# EAGLE schematic PRECISION_CLOCK V0.3 (EAGLE 9.6.2)
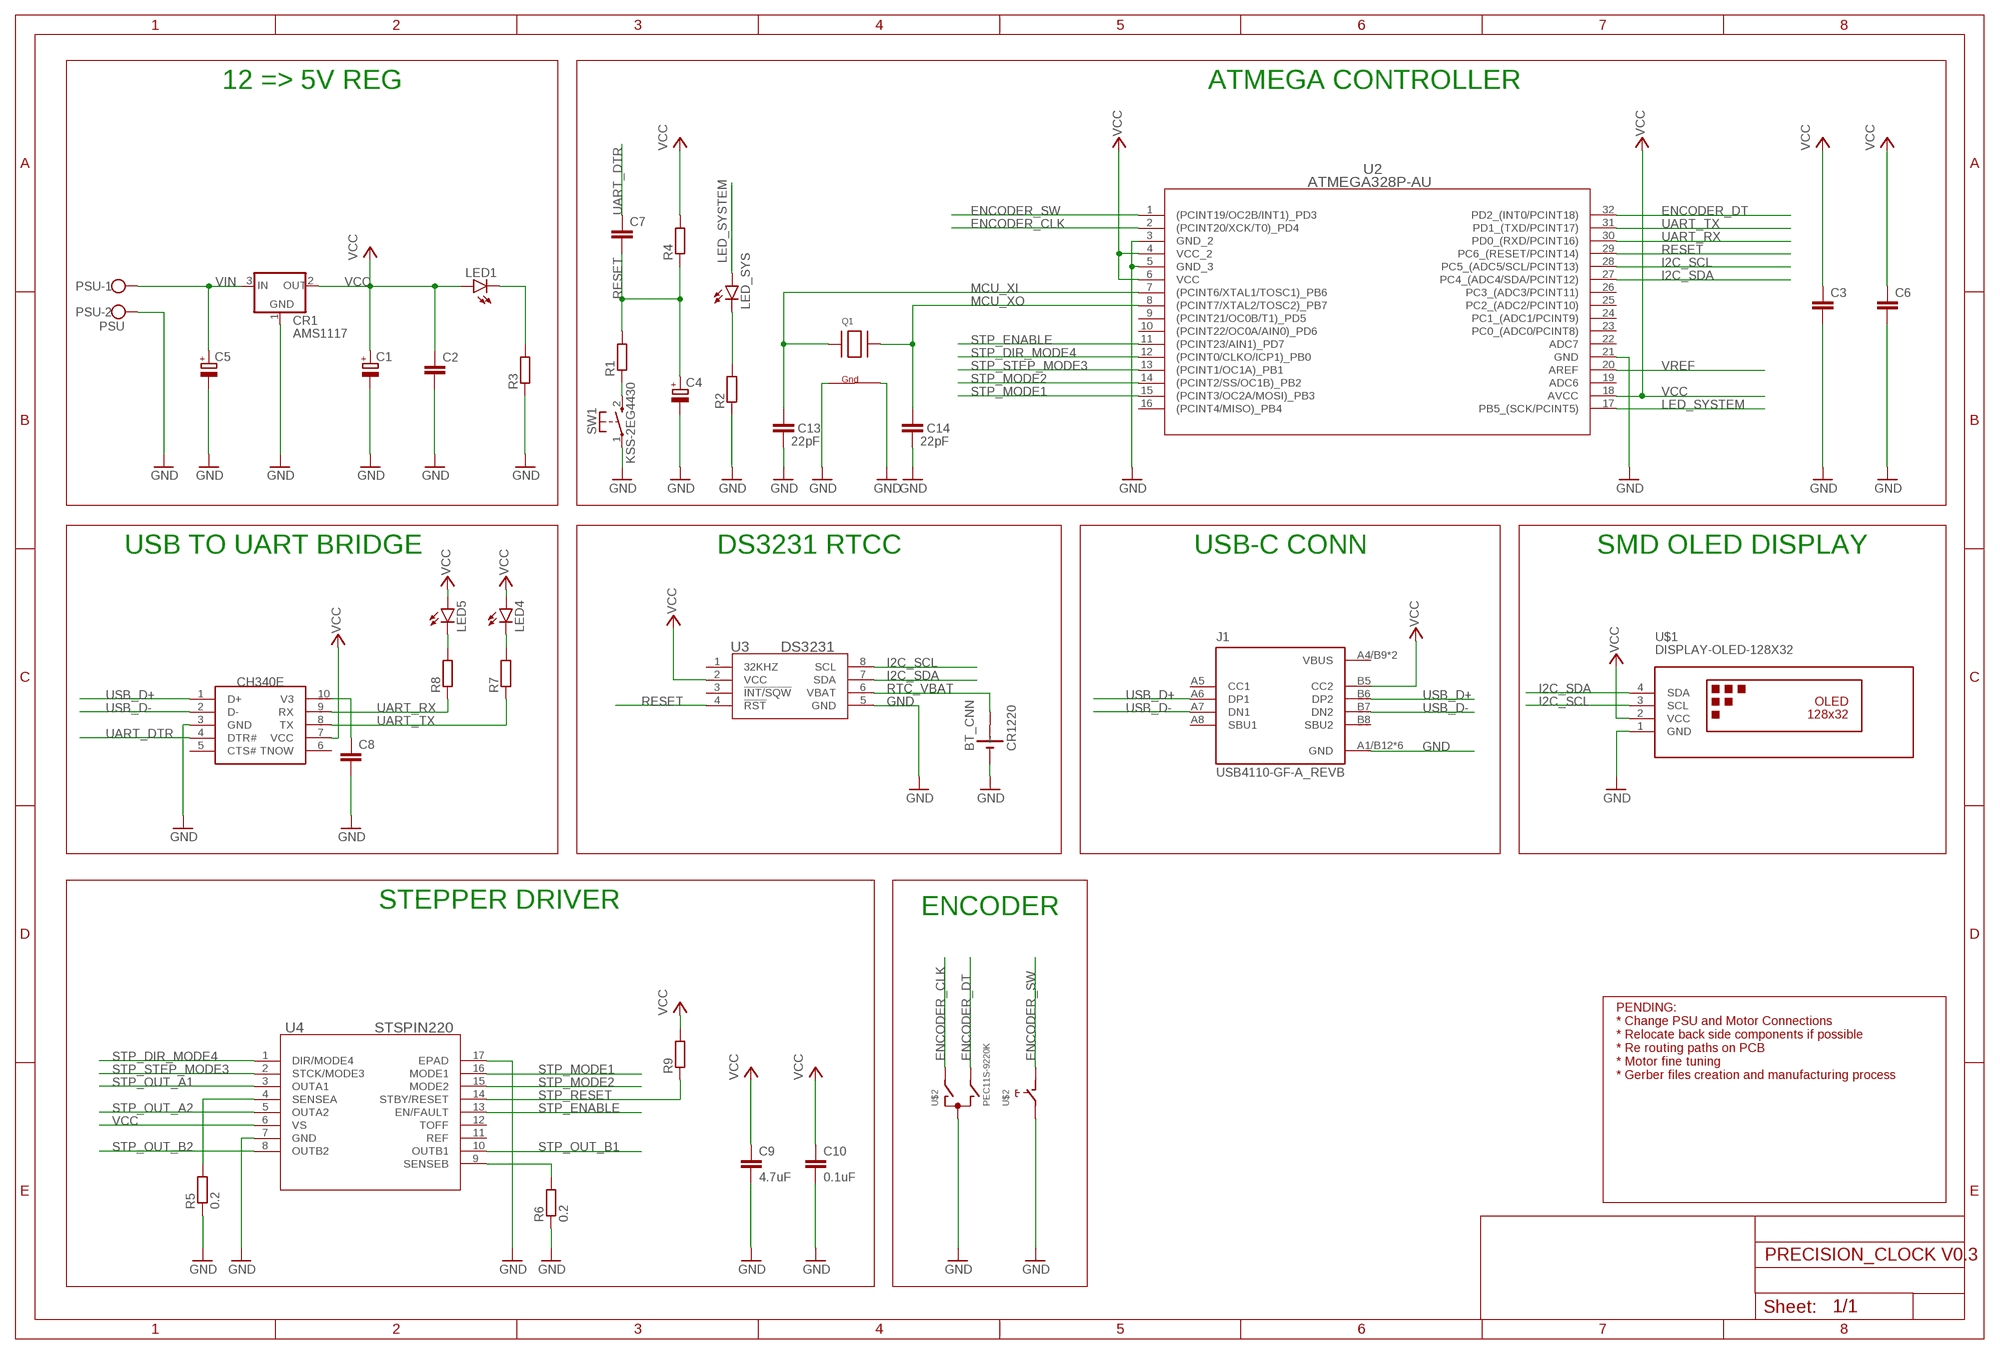
[diagram p0: schematic, sheet 1]

## Parts
BT_CNN  CR1220  [BH-44A-5]
C1  CPOL-EU153CLV-0505  [153CLV-0505]
C2  C-EUC0805  [C0805]
C3  C-EUC0805  [C0805]
C4  CPOL-EU153CLV-0505  [153CLV-0505]
C5  CPOL-EU153CLV-0505  [153CLV-0505]
C6  C-EUC0805  [C0805]
C7  C-EUC0805  [C0805]
C8  C-EUC0805  [C0805]
C9  4.7uF  C-EUC0805  [C0805]
C10  0.1uF  C-EUC0805  [C0805]
C13  22pF  C-EUC0805  [C0805]
C14  22pF  C-EUC0805  [C0805]
CR1  AMS1117  [SOT223]
J1  USB4110-GF-A_REVB  [GCT_USB4110-GF-A_REVB]
LED1  LEDSML0805  [SML0805]
LED4  LEDSML0805  [SML0805]
LED5  LEDSML0805  [SML0805]
LED_SYS  LEDSML0805  [SML0805]
PSU  PSU  W237-102  [W237-102]
Q1  XTAL-4-3225  [NX3225]
R1  R-EU_R0805  [R0805]
R2  R-EU_R0805  [R0805]
R3  R-EU_R0805  [R0805]
R4  R-EU_R0805  [R0805]
R5  0.2  R-EU_R0805  [R0805]
R6  0.2  R-EU_R0805  [R0805]
R7  R-EU_R0805  [R0805]
R8  R-EU_R0805  [R0805]
R9  R-EU_R0805  [R0805]
SW1  KSS-2EG4430  [KSS-2EG4430]
U2  ATMEGA328P-AU  [32A_ATM]
U3  DS3231  [21-0041B_8_MXM]
U4  STSPIN220  [VFQFPN-16_STM]
U$1  DISPLAY-OLED-128X32  [DISPLAY-OLED-128X32]
U$2  PEC11S-9220K  [PEC11S-9220K]
U$5  CH340E  [MSOP10]

## Nets
ENCODER_CLK: U2.2((PCINT20/XCK/T0)_PD4) U$2.P$A(A)
ENCODER_DT: U2.32(PD2_(INT0/PCINT18)) U$2.P$B(B)
ENCODER_SW: U2.1((PCINT19/OC2B/INT1)_PD3) U$2.P$D(D)
GND: BT_CNN.P$1(-) C1.- C2.2 C3.2 C4.- C5.- C6.2 C8.2 C9.2 C10.2 C13.2 C14.2 CR1.1(GROUND) J1.A1/B12(GND) J1.B1/A12(GND) J1.S1(GND) J1.S2(GND) J1.S3(GND) J1.S4(GND) PSU.2 Q1.2(G2) Q1.4(G1) R2.1 R3.1 R5.1 R6.1 SW1.1(P) U2.3(GND_2) U2.5(GND_3) U2.21(GND) U3.5(GND) U4.7(GND) U4.17(EPAD) U$1.1(GND) U$2.P$C(C) U$2.P$E(E) U$5.3(GND)
I2C_SCL: U2.28(PC5_(ADC5/SCL/PCINT13)) U3.8(SCL) U$1.3(SCL)
I2C_SDA: U2.27(PC4_(ADC4/SDA/PCINT12)) U3.7(SDA) U$1.4(SDA)
LED_SYSTEM: LED_SYS.A U2.17(PB5_(SCK/PCINT5))
MCU_XI: C13.1 Q1.1(X1) U2.7((PCINT6/XTAL1/TOSC1)_PB6)
MCU_XO: C14.1 Q1.3(X2) U2.8((PCINT7/XTAL2/TOSC2)_PB7)
N$1: LED_SYS.C R2.2
N$2: R5.2 U4.4(SENSEA)
N$3: LED1.C R3.2
N$4: R1.1 SW1.2(S)
N$5: R6.2 U4.9(SENSEB)
N$6: LED4.C R7.2
N$7: LED5.C R8.2
N$8: C8.1 U$5.10(V3)
RESET: C4.+ C7.2 R1.2 R4.1 U2.29(PC6_(RESET/PCINT14)) U3.4(!RST)
RTC_VBAT: BT_CNN.P$2(+) U3.6(VBAT)
STP_DIR_MODE4: U2.12((PCINT0/CLKO/ICP1)_PB0) U4.1(DIR/MODE4)
STP_ENABLE: U2.11((PCINT23/AIN1)_PD7) U4.13(EN/FAULT)
STP_MODE1: U2.15((PCINT3/OC2A/MOSI)_PB3) U4.16(MODE1)
STP_MODE2: U2.14((PCINT2/SS/OC1B)_PB2) U4.15(MODE2)
STP_OUT_A1: U4.3(OUTA1)
STP_OUT_A2: U4.5(OUTA2)
STP_OUT_B1: U4.10(OUTB1)
STP_OUT_B2: U4.8(OUTB2)
STP_RESET: R9.1 U4.14(STBY/RESET)
STP_STEP_MODE3: U2.13((PCINT1/OC1A)_PB1) U4.2(STCK/MODE3)
UART_DTR: C7.1 U$5.4(DTR#)
UART_RX: R8.1 U2.30(PD0_(RXD/PCINT16)) U$5.9(RX)
UART_TX: R7.1 U2.31(PD1_(TXD/PCINT17)) U$5.8(TX)
USB_D+: J1.A6(DP1) J1.B6(DP2) U$5.1(D+)
USB_D-: J1.A7(DN1) J1.B7(DN2) U$5.2(D-)
VCC: C1.+ C2.1 C3.1 C6.1 C9.1 C10.1 CR1.2(OUT) J1.B5(CC2) LED1.A LED4.A LED5.A R4.2 R9.2 U2.4(VCC_2) U2.6(VCC) U2.18(AVCC) U3.2(VCC) U4.6(VS) U$1.2(VCC) U$5.7(VCC)
VIN: C5.+ CR1.3(IN) PSU.1
VREF: U2.20(AREF)
Unconnected: J1.A5(CC1) J1.A8(SBU1) J1.B8(SBU2) U2.9((PCINT21/OC0B/T1)_PD5) U2.10((PCINT22/OC0A/AIN0)_PD6) U2.16((PCINT4/MISO)_PB4) U2.19(ADC6) U2.22(ADC7) U2.23(PC0_(ADC0/PCINT8)) U2.24(PC1_(ADC1/PCINT9)) U2.25(PC2_(ADC2/PCINT10)) U2.26(PC3_(ADC3/PCINT11)) U3.1(32KHZ) U3.3(!INT/SQW) U4.11(REF) U4.12(TOFF) U$5.5(CTS#) U$5.6(TNOW)

## Notes on the sheet
- 12 => 5V REG | ATMEGA CONTROLLER
- USB TO UART BRIDGE | DS3231 RTCC | USB-C CONN | SMD OLED DISPLAY
- STEPPER DRIVER | ENCODER
- PENDING:
  * Change PSU and Motor Connections
  * Relocate back side components if possible
  * Re routing paths on PCB
  * Motor fine tuning 
  * Gerber files creation and manufacturing process

## Power pins joined to a net without a drawn wire
VBUS: J1.A4/B9(VBUS) J1.B4/A9(VBUS)

## Library data of the parts
BT_CNN = CR1220:CR1220
C1 C4 C5 = resistor:CPOL-EU: POLARIZED CAPACITOR, European symbol
C2 C3 C6-C10 C13 C14 = resistor:C-EU: CAPACITOR, European symbol
CR1 = AMS1117:AMS1117
J1 = USB4110-GF-A_REVB:USB4110-GF-A_REVB: Check prices <https://pricing.snapeda.com/parts/USB4110-GF-A/GCT/view-part?ref=eda>; AVAILABILITY: In Stock; DESCRIPTION: USB-C (USB TYPE-C) USB 2.0 Receptacle Connector 24 (16+8 Dummy) Position Surface Mount, Right Angle; Through Hole; MF: GCT; MP: USB4110-GF-A; PACKAGE: None; PRICE: None; PURCHASE-URL: https://pricing.snapeda.com/search/part/USB4110-GF-A/?ref=eda
LED1 LED4 LED5 LED_SYS = led:LED: LED OSRAM: - CHIPLED LG R971, LG N971, LY N971, LG Q971, LY Q971, LO R971, LY R971 LH N974, LH R974 LS Q976, LO Q976, LY Q976 LO Q996 - Hyper CHIPLED LW Q18S LB Q993, LB Q99A, LB R99A - SideLED LS A670, LO A670, LY A670, LG A670, LP A670 LB A673, LV A673, LT A673, LW A673 LH A674 LY A675 LS A676, LA A676, LO A676, LY A676, LW A676 LS A679, LY A679, LG A679 - Hyper Micro SIDELED® LS Y876, LA Y876, LO Y876, LY Y876 LT Y87S - SmartLED LW L88C, LW L88S LB L89C, LB L89S, LG L890 LS L89K, LO L89K, LY L89K LS L896, LA L896, LO L896, LY L896 - TOPLED LS T670, LO T670, LY T670, LG T670, LP T670 LSG T670, LSP T670, LSY T670, LOP T670, LYG T670 LG T671, LOG T671, LSG T671 LB T673, LV T673, LT T673, LW T673 LH T674 LS T676, LA T676, LO T676, LY T676, LB T676, LH T676, LSB T676, LW T676 LB T67C, LV T67C, LT T67C, LS T67K, LO T67K, LY T67K, LW E67C LS E67B, LA E67B, LO E67B, LY E67B, LB E67C, LV E67C, LT E67C LW T67C LS T679, LY T679, LG T679 LS T770, LO T770, LY T770, LG T770, LP T770 LB T773, LV T773, LT T773, LW T773 LH T774 LS E675, LA E675, LY E675, LS T675 LS T776, LA T776, LO T776, LY T776, LB T776 LHGB T686 LT T68C, LB T68C - Hyper Mini TOPLED® LB M676 - Mini TOPLED Santana® LG M470 LS M47K, LO M47K, LY M47K Source: http://www.osram.convergy.de LUXEON: - LUMILED® LXK2-PW12-R00, LXK2-PW12-S00, LXK2-PW14-U00, LXK2-PW14-V00 LXK2-PM12-R00, LXK2-PM12-S00, LXK2-PM14-U00 LXK2-PE12-Q00, LXK2-PE12-R00, LXK2-PE12-S00, LXK2-PE14-T00, LXK2-PE14-U00 LXK2-PB12-K00, LXK2-PB12-L00, LXK2-PB12-M00, LXK2-PB14-N00, LXK2-PB14-P00, LXK2-PB14-Q00 LXK2-PR12-L00, LXK2-PR12-M00, LXK2-PR14-Q00, LXK2-PR14-R00 LXK2-PD12-Q00, LXK2-PD12-R00, LXK2-PD12-S00 LXK2-PH12-R00, LXK2-PH12-S00 LXK2-PL12-P00, LXK2-PL12-Q00, LXK2-PL12-R00 Source: www.luxeon.com KINGBRIGHT: KA-3528ASYC Source: www.kingbright.com
PSU = con-wago-500:W237-102: WAGO SCREW CLAMP; MPN: 237-102; OC_FARNELL: unknown; OC_NEWARK: 70K9898
Q1 = adafruit:XTAL-4: Classic 4-pin 3.2 x 2.5mm crystal
R1-R9 = resistor:R-EU_: RESISTOR, European symbol
SW1 = buttons:KSS-2EG4430: Size: 3x6mm Height: 5mm from PCB Rating: DC12v 50mA Travel: 0.25±0.10mm Operating Force: 180±50gf Return Force: 60gf min Contact resistance: 100m? max Insulation resistance: 100M? min Operating life?50,000 cycles
U2 = Atmega328P:ATMEGA328P-AU; BUILT_BY: EMA_UL_Team; MANUFACTURER_PART_NUMBER: ATMEGA328P-AU; SOURCELIBRARY: Atmel_2011-04-02; VENDOR: Atmel
U3 = DS3231:DS3231; BUILT_BY: EMA_UL_Team; MANUFACTURER_PART_NUMBER: DS3231MZ/V+T; REVISION: 3; SOURCELIBRARY: Maxim_2014-04-30_1; VENDOR: Maxim Integrated Products
U4 = STSPIN220:STSPIN220; BUILT_BY: EMA_Jessica; COPYRIGHT: Copyright (C) 2018 Accelerated Designs. All rights reserved; MANUFACTURER_PART_NUMBER: STSPIN220; SOURCELIBRARY: Update_to_database_2020-12-04; VENDOR: STMicroelectronics
U$1 = diy-modules:DISPLAY-OLED-128X32: 128x32 Dot Matrix OLED Module with I2C interface based on SSD1306 chip More details available here: http://www.tinyosshop.com/index.php?route=product/product&product_id=953 Schematic available here: http://www.tinyosshop.com/datasheet/OLED%2012832.pdf SSD1306 datasheet: https://cdn-shop.adafruit.com/datasheets/SSD1306.pdf Click here to find device on ebay.com <http://www.ebay.com/sch/oled+display+128x32+i2c>
U$2 = PEC11S-9220K_ENCODER:PEC11S-9220K
U$5 = ch340E:CH340E